# Altium schematic sheet Acoustics Board Sheet 1.SchDoc: Sample Sheet Title
size B; Date: 10/22/2023; Author: Nathan A, Rebecca Y, Rebecca L; Organization: ORGANIZATION; Address1: ADDRESS 1; Address2: ADDRESS 2; Address3: ADDRESS 3; Address4: ADDRESS 4; Revision: -; SheetNumber: 2; SheetTotal: 5; ENG_APP_DATE: --/--/--; DSN_APP_DATE: --/--/--; CHK_APP_DATE: --/--/--
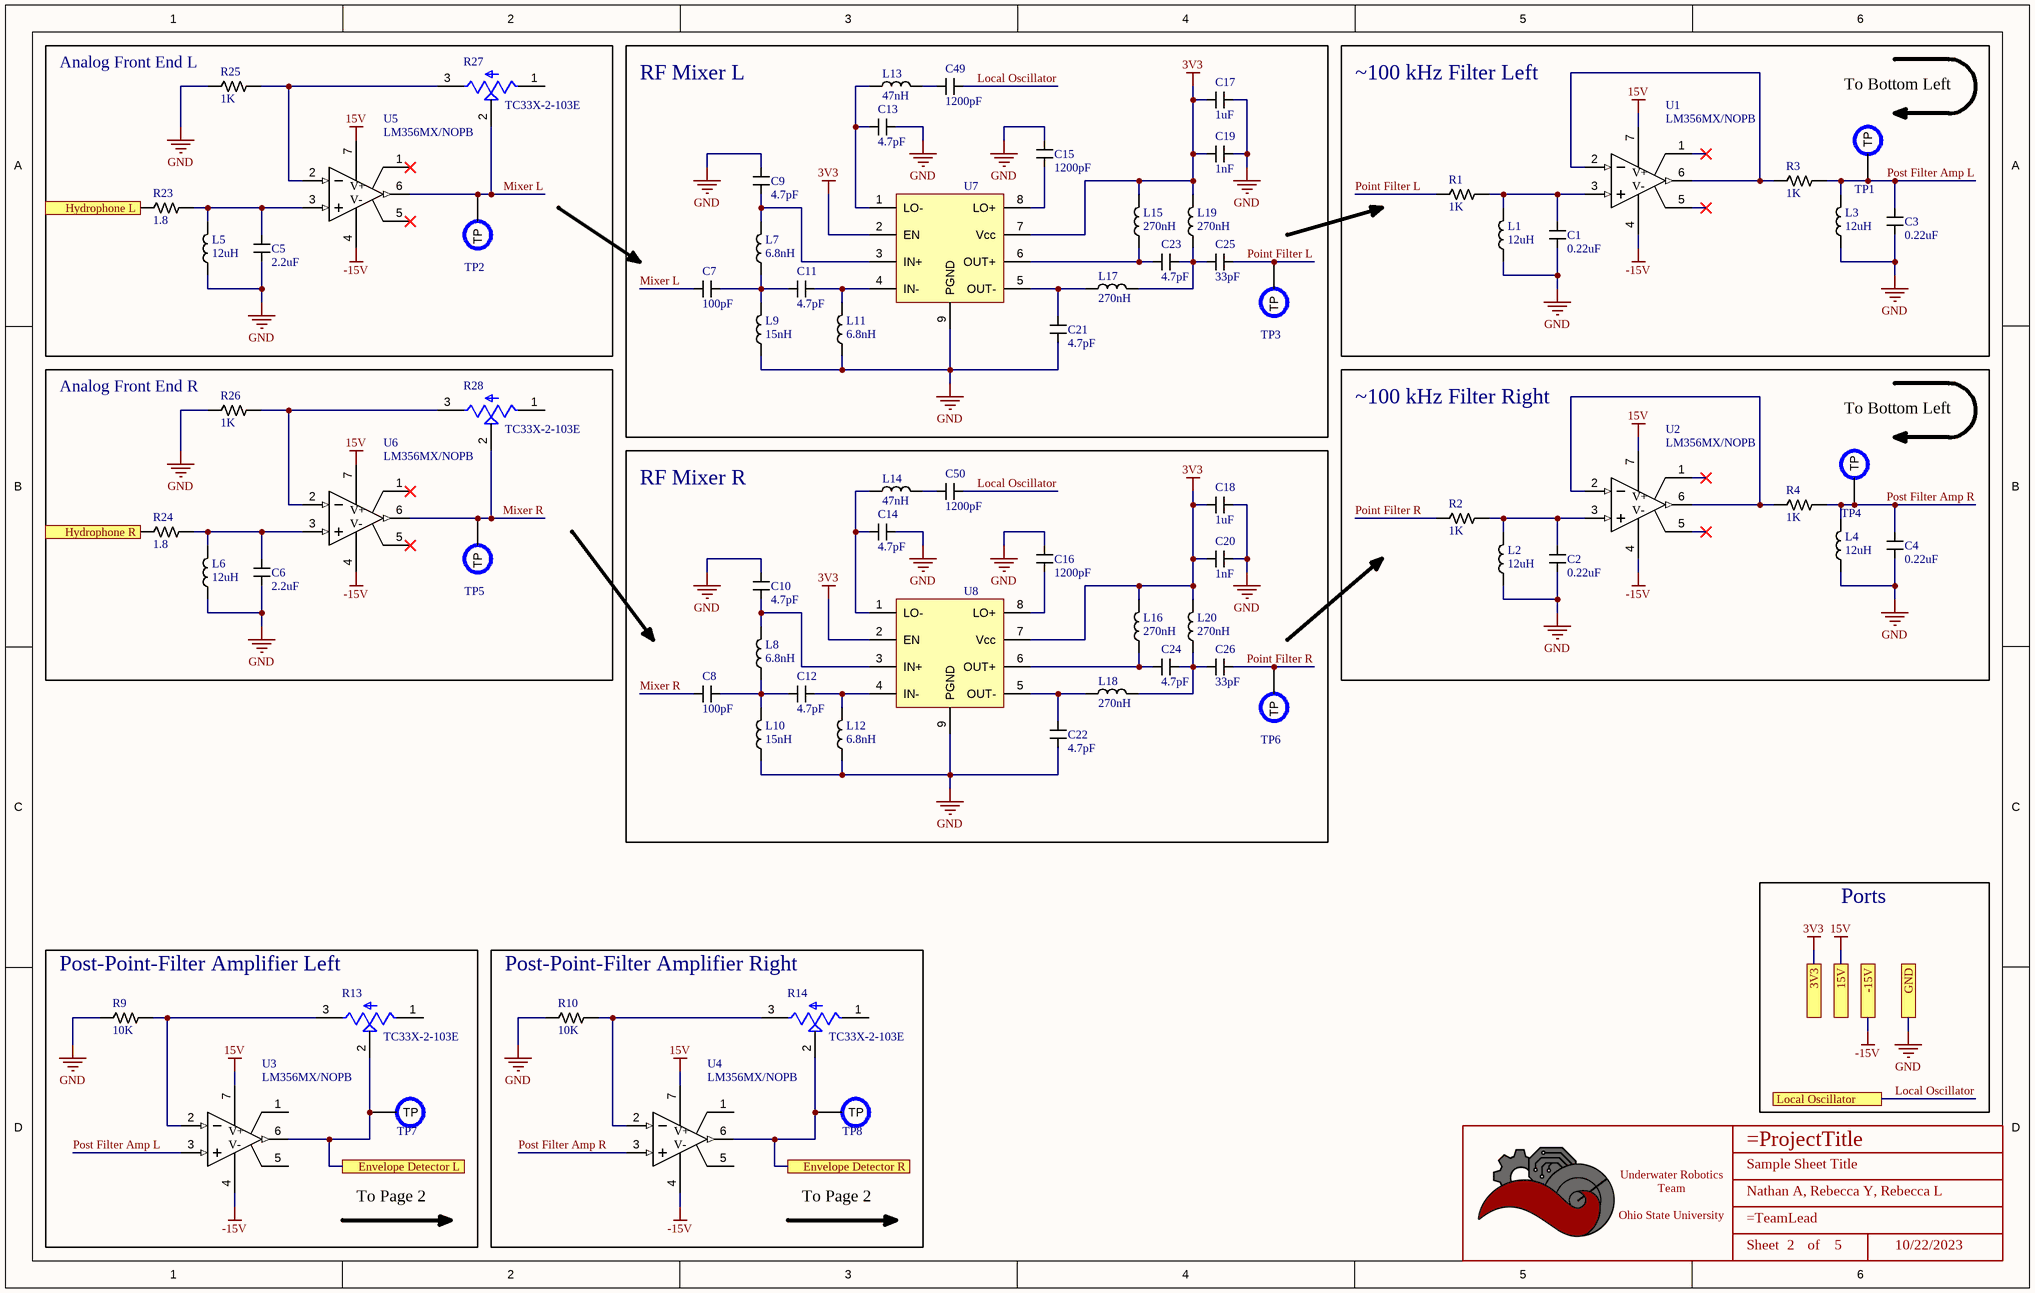
[diagram p0: Acoustics Board Sheet 1.SchDoc]

## Parts
*  Title_Block  [LOGO]  (value not drawn)  (graphical)
C1  value 0.22uF  [CAPACITOR_0603]  (hidden comment: 0.22uF Ceramic 16V)
C2  value 0.22uF  [CAPACITOR_0603]  (hidden comment: 0.22uF Ceramic 16V)
C3  value 0.22uF  [CAPACITOR_0603]  (hidden comment: 0.22uF Ceramic 16V)
C4  value 0.22uF  [CAPACITOR_0603]  (hidden comment: 0.22uF Ceramic 16V)
C5  value 2.2uF  [CAPACITOR_0603]  (hidden comment: 22uF Ceramic)
C6  value 2.2uF  [CAPACITOR_0603]  (hidden comment: 22uF Ceramic)
C7  value 100pF  [CAPACITOR_0402]  (hidden comment: 100pF Ceramic 25V)
C8  value 100pF  [CAPACITOR_0402]  (hidden comment: 100pF Ceramic 25V)
C9  value 4.7pF  [CAPACITOR_0402]  (hidden comment: CAP CER 4.7PF 50V C0G/NP0 0402)
C10  value 4.7pF  [CAPACITOR_0402]  (hidden comment: CAP CER 4.7PF 50V C0G/NP0 0402)
C11  value 4.7pF  [CAPACITOR_0402]  (hidden comment: CAP CER 4.7PF 50V C0G/NP0 0402)
C12  value 4.7pF  [CAPACITOR_0402]  (hidden comment: CAP CER 4.7PF 50V C0G/NP0 0402)
C13  value 4.7pF  [CAPACITOR_0402]  (hidden comment: CAP CER 4.7PF 50V C0G/NP0 0402)
C14  value 4.7pF  [CAPACITOR_0402]  (hidden comment: CAP CER 4.7PF 50V C0G/NP0 0402)
C15  value 1200pF  [CAPACITOR_0402]  (hidden comment: 1200pF Ceramic 50V)
C16  value 1200pF  [CAPACITOR_0402]  (hidden comment: 1200pF Ceramic 50V)
C17  value 1uF  [CAPACITOR_0603]  (hidden comment: 1uF Ceramic 25V)
C18  value 1uF  [CAPACITOR_0603]  (hidden comment: 1uF Ceramic 25V)
C19  value 1nF  [CAPACITOR_0603]  (hidden comment: 1000pF Ceramic 50V)
C20  value 1nF  [CAPACITOR_0603]  (hidden comment: 1000pF Ceramic 50V)
C21  value 4.7pF  [CAPACITOR_0402]  (hidden comment: CAP CER 4.7PF 50V C0G/NP0 0402)
C22  value 4.7pF  [CAPACITOR_0402]  (hidden comment: CAP CER 4.7PF 50V C0G/NP0 0402)
C23  value 4.7pF  [CAPACITOR_0402]  (hidden comment: CAP CER 4.7PF 50V C0G/NP0 0402)
C24  value 4.7pF  [CAPACITOR_0402]  (hidden comment: CAP CER 4.7PF 50V C0G/NP0 0402)
C25  value 33pF  [CAPACITOR_0603]  (hidden comment: CAP CER 33PF 250V C0G/NP0 0603)
C26  value 33pF  [CAPACITOR_0603]  (hidden comment: CAP CER 33PF 250V C0G/NP0 0603)
C49  value 1200pF  [CAPACITOR_0402]  (hidden comment: 1200pF Ceramic 50V)
C50  value 1200pF  [CAPACITOR_0402]  (hidden comment: 1200pF Ceramic 50V)
L1  value 12uH  [INDUCTOR_0603]  (hidden comment: FIXED IND 12UH 10MA 1.8 OHM SMD)
L2  value 12uH  [INDUCTOR_0603]  (hidden comment: FIXED IND 12UH 10MA 1.8 OHM SMD)
L3  value 12uH  [INDUCTOR_0603]  (hidden comment: FIXED IND 12UH 10MA 1.8 OHM SMD)
L4  value 12uH  [INDUCTOR_0603]  (hidden comment: FIXED IND 12UH 10MA 1.8 OHM SMD)
L5  value 12uH  [INDUCTOR_0603]  (hidden comment: FIXED IND 12UH 10MA 1.8 OHM SMD)
L6  value 12uH  [INDUCTOR_0603]  (hidden comment: FIXED IND 12UH 10MA 1.8 OHM SMD)
L7  value 6.8nH  [INDUCTOR_0402]  (hidden comment: FIXED IND 6.8NH 250MA 320MOHM SM)
L8  value 6.8nH  [INDUCTOR_0402]  (hidden comment: FIXED IND 6.8NH 250MA 320MOHM SM)
L9  value 15nH  [INDUCTOR_0402]  (hidden comment: FIXED IND 15NH 250MA 600MOHM SMD)
L10  value 15nH  [INDUCTOR_0402]  (hidden comment: FIXED IND 15NH 250MA 600MOHM SMD)
L11  value 6.8nH  [INDUCTOR_0402]  (hidden comment: FIXED IND 6.8NH 250MA 320MOHM SM)
L12  value 6.8nH  [INDUCTOR_0402]  (hidden comment: FIXED IND 6.8NH 250MA 320MOHM SM)
L13  value 47nH  [INDUCTOR_0402]  (hidden comment: FIXED IND 47NH 200MA 1.1 OHM SMD)
L14  value 47nH  [INDUCTOR_0402]  (hidden comment: FIXED IND 47NH 200MA 1.1 OHM SMD)
L15  value 270nH  [INDUCTOR_0402]  (hidden comment: FIXED IND 270NH 110MA 4.94OHM SM)
L16  value 270nH  [INDUCTOR_0402]  (hidden comment: FIXED IND 270NH 110MA 4.94OHM SM)
L17  value 270nH  [INDUCTOR_0402]  (hidden comment: FIXED IND 270NH 110MA 4.94OHM SM)
L18  value 270nH  [INDUCTOR_0402]  (hidden comment: FIXED IND 270NH 110MA 4.94OHM SM)
L19  value 270nH  [INDUCTOR_0402]  (hidden comment: FIXED IND 270NH 110MA 4.94OHM SM)
L20  value 270nH  [INDUCTOR_0402]  (hidden comment: FIXED IND 270NH 110MA 4.94OHM SM)
R1  Value  (Ohms): 1K  [RESISTOR_0603]  (hidden comment: 1.45k Ohm 0.1% 1/10W)
R2  Value  (Ohms): 1K  [RESISTOR_0603]  (hidden comment: 1.45k Ohm 0.1% 1/10W)
R3  Value  (Ohms): 1K  [RESISTOR_0603]  (hidden comment: 1.45k Ohm 0.1% 1/10W)
R4  Value  (Ohms): 1K  [RESISTOR_0603]  (hidden comment: 1.45k Ohm 0.1% 1/10W)
R9  Value  (Ohms): 10K  [RESISTOR_0603]  (hidden comment: 10k Ohm 0.5% 1/10W)
R10  Value  (Ohms): 10K  [RESISTOR_0603]  (hidden comment: 10k Ohm 0.5% 1/10W)
R13  TC33X-2-103E  [TRIM_TC33X-2-203E]
R14  TC33X-2-103E  [TRIM_TC33X-2-203E]
R23  Value  (Ohms): 1.8  [RESISTOR_0402]  (hidden comment: 2k Ohm 1% 1/16W)
R24  Value  (Ohms): 1.8  [RESISTOR_0402]  (hidden comment: 2k Ohm 1% 1/16W)
R25  Value  (Ohms): 1K  [RESISTOR_0603]  (hidden comment: 1k Ohm 5% 1/8W)
R26  Value  (Ohms): 1K  [RESISTOR_0603]  (hidden comment: 1k Ohm 5% 1/8W)
R27  TC33X-2-103E  [TRIM_TC33X-2-203E]
R28  TC33X-2-103E  [TRIM_TC33X-2-203E]
TP1  PCB Test Point  [TESTPOINT_1.2MM]  (value not drawn)  (no BOM)
TP2  PCB Test Point  [TESTPOINT_1.2MM]  (value not drawn)  (no BOM)
TP3  PCB Test Point  [TESTPOINT_1.2MM]  (value not drawn)  (no BOM)
TP4  PCB Test Point  [TESTPOINT_1.2MM]  (value not drawn)  (no BOM)
TP5  PCB Test Point  [TESTPOINT_1.2MM]  (value not drawn)  (no BOM)
TP6  PCB Test Point  [TESTPOINT_1.2MM]  (value not drawn)  (no BOM)
TP7  PCB Test Point  [TESTPOINT_1.2MM]  (value not drawn)  (no BOM)
TP8  PCB Test Point  [TESTPOINT_1.2MM]  (value not drawn)  (no BOM)
U1  LM356MX/NOPB  [SOIC-8]
U2  LM356MX/NOPB  [SOIC-8]
U3  LM356MX/NOPB  [SOIC-8]
U4  LM356MX/NOPB  [SOIC-8]
U5  LM356MX/NOPB  [SOIC-8]
U6  LM356MX/NOPB  [SOIC-8]
U7  LT5560EDD  [LT5560EDD]  (value not drawn)
U8  LT5560EDD  [LT5560EDD]  (value not drawn)

## Blocks framed on the sheet
Analog Front End L: C5 L5 R23 R25 R27 TP2 U5
RF Mixer L: C7 C9 C11 C13 C15 C17 C19 C21 C23 C25 C49 L7 L9 L11 L13 L15 L17 L19 TP3 U7
~100 kHz Filter Left: C1 C3 L1 L3 R1 R3 TP1 U1
Analog Front End R: C6 L6 R24 R26 R28 TP5 U6
~100 kHz Filter Right: C2 C4 L2 L4 R2 R4 TP4 U2
RF Mixer R: C8 C10 C12 C14 C16 C18 C20 C22 C24 C26 C50 L8 L10 L12 L14 L16 L18 L20 TP6 U8
Post-Point-Filter Amplifier Left: R9 R13 TP7 U3
Post-Point-Filter Amplifier Right: R10 R14 TP8 U4

## Ports
3V3, 15V, -15V, Envelope Detector L, Envelope Detector R, GND, Hydrophone L, Hydrophone R, Local Oscillator

## Nets
3V3: C17.2 C18.2 C19.2 C20.2 L15.1 L16.1 L19.1 L20.1 U7.2(EN) U7.7(Vcc) U8.2(EN) U8.7(Vcc) ; port 3V3
15V: U1.7(V+) U2.7(V+) U3.7(V+) U4.7(V+) U5.7(V+) U6.7(V+) ; port 15V
-15V: U1.4(V-) U2.4(V-) U3.4(V-) U4.4(V-) U5.4(V-) U6.4(V-) ; port -15V
GND: C1.2 C2.2 C3.2 C4.2 C5.2 C6.2 C9.1 C10.1 C13.1 C14.1 C15.1 C16.1 C17.1 C18.1 C19.1 C20.1 C21.2 C22.2 L1.2 L2.2 L3.2 L4.2 L5.2 L6.2 L9.2 L10.2 L11.2 L12.2 R9.2 R10.2 R25.2 R26.2 U7.9(PGND) U8.9(PGND) ; port GND
Envelope Detector L: R13.2(W) TP7.TP U3.6(OUT) ; port Envelope Detector L
Envelope Detector R: R14.2(W) TP8.TP U4.6(OUT) ; port Envelope Detector R
Hydrophone L: R23.2 ; port Hydrophone L
Hydrophone R: R24.2 ; port Hydrophone R
Local Oscillator: C49.1 C50.1 ; port Local Oscillator
Mixer L: C7.1 R27.2(W) TP2.TP U5.6(OUT)
Mixer R: C8.1 R28.2(W) TP5.TP U6.6(OUT)
Point Filter L: C25.1 R1.2 TP3.TP
Point Filter R: C26.1 R2.2 TP6.TP
Post Filter Amp L: C3.1 L3.1 R3.1 TP1.TP U3.3(IN+)
Post Filter Amp R: C4.1 L4.1 R4.1 TP4.TP U4.3(IN+)
NetC1_1: C1.1 L1.1 R1.1 U1.3(IN+)
NetC2_1: C2.1 L2.1 R2.1 U2.3(IN+)
NetC5_1: C5.1 L5.1 R23.1 U5.3(IN+)
NetC6_1: C6.1 L6.1 R24.1 U6.3(IN+)
NetC7_2: C7.2 C11.2 L7.2 L9.1
NetC8_2: C8.2 C12.2 L8.2 L10.1
NetC9_2: C9.2 L7.1 U7.3(IN+)
NetC10_2: C10.2 L8.1 U8.3(IN+)
NetC11_1: C11.1 L11.1 U7.4(IN-)
NetC12_1: C12.1 L12.1 U8.4(IN-)
NetC13_2: C13.2 L13.2 U7.1(LO-)
NetC14_2: C14.2 L14.2 U8.1(LO-)
NetC15_2: C15.2 U7.8(LO+)
NetC16_2: C16.2 U8.8(LO+)
NetC21_1: C21.1 L17.2 U7.5(OUT-)
NetC22_1: C22.1 L18.2 U8.5(OUT-)
NetC23_1: C23.1 C25.2 L17.1 L19.2
NetC23_2: C23.2 L15.2 U7.6(OUT+)
NetC24_1: C24.1 C26.2 L18.1 L20.2
NetC24_2: C24.2 L16.2 U8.6(OUT+)
NetC49_2: C49.2 L13.1
NetC50_2: C50.2 L14.1
NetR3_2: R3.2 U1.2(IN-) U1.6(OUT)
NetR4_2: R4.2 U2.2(IN-) U2.6(OUT)
NetR9_1: R9.1 R13.3(CW) U3.2(IN-)
NetR10_1: R10.1 R14.3(CW) U4.2(IN-)
NetR25_1: R25.1 R27.3(CW) U5.2(IN-)
NetR26_1: R26.1 R28.3(CW) U6.2(IN-)

Not connected (* = marked no-connect by the designer): R13 1(CCW); R14 1(CCW); R27 1(CCW); R28 1(CCW); U1 1(Balance)* 5(Balance)*; U2 1(Balance)* 5(Balance)*; U3 1(Balance) 5(Balance); U4 1(Balance) 5(Balance); U5 1(Balance)* 5(Balance)*; U6 1(Balance)* 5(Balance)*

## Notes on the sheet
- To Bottom Left
- Ports
- To Page 2
- DWG. NO.
- REV.
- SHT.
- THIS DOCUMENT AND THE DATA DISCLOSED HEREIN OR HEREWITH IS THE PROPERTY OF ALTIUM LIMITED AND MAY BE FREELY DISTRIBUTED IN WHOLE. NO RIGHTS ARE RESERVED OR EXPRESS OR IMPLIED WARANTEE GIVEN.
- REVISION
- DESCRIPTION
- DATE
- APPROVED
- ENG:
- APPROVALS
- PROJECT
- DSN:
- CHK:
- REFERENCE DOCUMENTS
- PROJECT REVISION:
- TITLE
- DOCUMENT REVISION:
- DESIGN ITEM:
- BOM:
- FAB DWG:
- PCB DWG:
- ASSY DWG:
- SCALE:
- SIZE
- B
- CAGE CODE
- FILE NAME
- DWG NO.
- SHEET
- OF
- REV
- (in symbol Title_Block) Underwater Robotics Team / Ohio State University; Sheet; of

## Library data of the parts
* = Title_Block: UWRT Schematic Title Block Template / Created June 2021, Dylan Trainor
C1-C4 = CAPACITOR_0.000027uF_0603: CAP CER 0.22uF 16V X7R 0603; Tolerance: +/- 5%; Made By: Nathan Ayer; Voltage: 16V; ComponentLink2Description: Digikey; ComponentLink2URL: https://www.digikey.com/en/products/detail/yageo/CC0603JRX7R7BB224/5883645
C5 C6 = CAPACITOR_22uF_0603: CAP CER 2.2PF 50V C0G/NP0 0603; Tolerance: +/- 20%; Voltage: 6.3V; Made By: Flip B; Supplier 1: Digi-Key; Supplier Part Number 1: 445-8028-1-ND
C7 C8 = CAPACITOR_0.0001uF_0402: Cap 100pF 25V +/-10% / Ceramic 0402; Made By: Robert Pafford; Tolerance: +/- 10%; Voltage: 25V; Supplier 1: Digikey; Supplier Part Number 1: 399-C0402C101K3GAC7867CT-ND
C9-C14 C21-C24 = CAPACITOR_0.000015uF_0402: 4.7 pF ±0.1pF 50V Ceramic Capacitor C0G, NP0 0402 (1005 Metric); Tolerance: +/- 0.1 pF; Voltage: 50V
C15 C16 C49 C50 = CAPACITOR_0.0012uF_0402: CAP CER 1200PF 50V X7R 0402; Tolerance: +/- 5%; Made By: Robert Pafford; Voltage: 50V; Supplier 1: Future Electronics; Supplier Part Number 1: 5334081
C17 C18 = CAPACITOR_1uF_0603_25V: Cap 1uF 25V +/-10% / Ceramic 0603; Voltage: 16V; Made By: Flip B; Tolerance: +/- 10%; Supplier 1: Future Electronics; Supplier Part Number 1: 5636071
C19 C20 = CAPACITOR_0.001uF_0603: Cap 1000pF 50V +/-2% / Ceramic 0603; Voltage: 50; Made By: Flip B; ComponentLink1Description: Datsheet; ComponentLink1URL: https://datasheets.avx.com/C0GNP0-Dielectric.pdf; Tolerance: +/- 2%; Supplier 1: Arrow Electronics; Supplier Part Number 1: C0603C102K5RACTU
C25 C26 = CAPACITOR_0.001uF_0603: 33 pF ±5% 250V Ceramic Capacitor C0G, NP0 0603 (1608 Metric); Tolerance: +/- 5%; ComponentLink1Description: Datsheet; ComponentLink1URL: https://datasheets.avx.com/C0GNP0-Dielectric.pdf; Voltage: 250V
L1-L4 = INDUCTOR_12uH_0603: 12 µH Shielded Multilayer Inductor 10 mA 1.8Ohm Max 0603 (1608 Metric); Tolerance: +/- 5%; Made By: Nathan Ayer; DC Resistance: 1.8Ohm; Current Rating: 10mA; ComponentLink1Description: Digikey; ComponentLink1URL: https://www.digikey.com/en/products/detail/tdk-corporation/MLF1608E120JTD25/4743066
L5 L6 = INDUCTOR_12uH_0603: 12 µH Shielded Multilayer Inductor 10 mA 1.8Ohm Max 0603 (1608 Metric); Tolerance: +/- 20%; Made By: Robert Pafford; DC Resistance: 36mOhm; Current Rating: 2.1A; Supplier 1: Arrow Electronics; Supplier Part Number 1: MLF1608E120JTD25
L7 L8 L11 L12 = INDUCTOR_15nH_0402: 6.8 nH Unshielded Multilayer Inductor 250 mA 320mOhm Max 0402 (1005 Metric); Tolerance: +/- 5%
L9 L10 = INDUCTOR_15nH_0402: 15 nH Unshielded Multilayer Inductor 250 mA 600mOhm Max 0402 (1005 Metric); Tolerance: +/- 5%
L13 L14 = INDUCTOR_15nH_0402: 47 nH Unshielded Multilayer Inductor 200 mA 1.1Ohm Max 0402 (1005 Metric); Tolerance: +/- 5%
L15-L20 = INDUCTOR_15nH_0402: 270 nH Unshielded Multilayer Inductor 110 mA 4.94Ohm Max 0402 (1005 Metric); Tolerance: +/- 10%
R1-R4 = RESISTOR_1K_0603: RES 1.45K OHM 0.1% 1/10W 0603; Tolerance: +/- 0.1%; Made By: Nathan Ayer; ComponentLink1Description: Digikey; ComponentLink1URL: https://www.digikey.com/en/products/detail/koa-speer-electronics-inc/RN73H1JTTD1451B50/10688964; Wattage: 1/10W; Supplier: Digikey; Digikey Part Numer: CR0603-JW-104ELFTR-ND
R9 R10 = RESISTOR_10K_0.5%_0603: RES 10k OHM 0.5% 1/10W 0603; Tolerance: +/- 0.5%; Made By: Robert Pafford; Wattage: 1/10W; Supplier: Digikey; Digikey Part Numer: CR0603-JW-104ELFTR-ND; Supplier 1: Digi-Key; Supplier Part Number 1: 749-1695-1-ND
R13 R14 R27 R28 = TC33X-2-203E: 20 kOhms 0.1W, 1/10W J Lead Surface Mount Trimmer Potentiometer Cermet 1 Turn Top Adjustment; MF: Bourns; Value: *; Digi-Key_Part_Number: TC33X-2-203ECT-ND; Package: 1608 Bourns; MP: TC33X-2-203E; SnapEDA_Link: https://www.snapeda.com/parts/TC33X-2-203E/Bourns/view-part/312812/?ref=snap; Check_prices: https://www.snapeda.com/parts/TC33X-2-203E/Bourns/view-part/312812/?ref=eda; Purchase-URL: https://pricing.snapeda.com/search/part/TC33X-2-203E/?ref=eda
R23 R24 = RESISTOR_2K_0402: RES 2k OHM 1% 1/16W 0402; Tolerance: +/- 1%; Made By: Flip B; Wattage: 1/16W; Supplier 1: Digi-Key; Supplier Part Number 1: 311-2KLRCT-ND
R25 = RESISTOR_1K_0603: RES 1.8 OHM 5% 1/8W 0603; Tolerance: +/- 5%; Made By: Robert Pafford; ComponentLink1Description: Datasheet; ComponentLink1URL: https://www.bourns.com/docs/product-datasheets/CRxxxxx.pdf; Wattage: 1/8W; Supplier: Digikey; Digikey Part Numer: CR0603-JW-104ELFTR-ND; Supplier 1: Digi-Key; Supplier Part Number 1: 2019-RK73B1JTTD102JCT-ND
R26 = RESISTOR_1K_0603: RES 1k OHM 5% 1/8W 0603; Tolerance: +/- 5%; Made By: Robert Pafford; ComponentLink1Description: Datasheet; ComponentLink1URL: https://www.bourns.com/docs/product-datasheets/CRxxxxx.pdf; Wattage: 1/8W; Supplier: Digikey; Digikey Part Numer: CR0603-JW-104ELFTR-ND; Supplier 1: Digi-Key; Supplier Part Number 1: 2019-RK73B1JTTD102JCT-ND
TP1-TP8 = TESTPOINT: Made By: Robert Pafford
U1-U6 = LM356MX/NOPB: IC OPAMP JFET 1 CIRCUIT 8SOIC; PartNumber: LM8261M5X/NOPB; Manufacturer: Texas Instruments; Supply Current: 1.3 mA; Supply Voltage: 2.5 V ~ 30 V, +/- 1.25 V ~ 15 V; Gain Bandwidth Product: 21 MHz; Created By: Dylan T; ComponentLink1Description: Digi-Key; ComponentLink1URL: https://www.digikey.com/en/products/detail/texas-instruments/LF356MX-NOPB/366701
U7 U8 = LT5560EDD: RF Mixer IC CATV, DBS, PHS, UHF, VHF Up/Down Converter 10kHz ~ 4GHz 8-DFN (3x3)